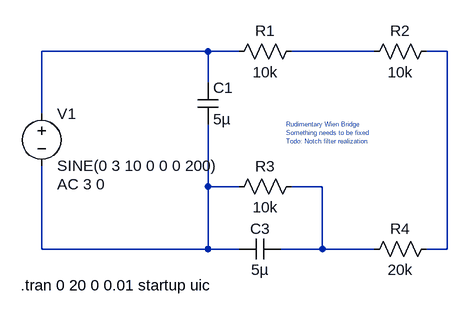
[diagram p0: schematic Wien Bridge (initial).asc]
Wien Bridge (initial).asc, the LTspice schematic file:
Version 4.1
SHEET 1 880 680
WIRE 288 32 32 32
WIRE 336 32 288 32
WIRE 544 32 416 32
WIRE 656 32 624 32
WIRE 288 80 288 32
WIRE 32 128 32 32
WIRE 288 240 288 144
WIRE 336 240 288 240
WIRE 464 240 416 240
WIRE 32 336 32 208
WIRE 288 336 288 240
WIRE 288 336 32 336
WIRE 336 336 288 336
WIRE 464 336 464 240
WIRE 464 336 400 336
WIRE 544 336 464 336
WIRE 656 336 656 32
WIRE 656 336 624 336
SYMBOL voltage 32 112 R0
WINDOW 123 24 124 Left 2
WINDOW 39 0 0 Left 0
SYMATTR InstName V1
SYMATTR Value SINE(0 3 10 0 0 0 200)
SYMATTR Value2 AC 3 0
SYMBOL res 432 16 R90
WINDOW 0 0 56 VBottom 2
WINDOW 3 32 56 VTop 2
SYMATTR InstName R1
SYMATTR Value 10k
SYMBOL res 640 16 R90
WINDOW 0 0 56 VBottom 2
WINDOW 3 32 56 VTop 2
SYMATTR InstName R2
SYMATTR Value 10k
SYMBOL res 432 224 R90
WINDOW 0 0 56 VBottom 2
WINDOW 3 32 56 VTop 2
SYMATTR InstName R3
SYMATTR Value 10k
SYMBOL res 640 320 R90
WINDOW 0 0 56 VBottom 2
WINDOW 3 32 56 VTop 2
SYMATTR InstName R4
SYMATTR Value 20k
SYMBOL cap 272 80 R0
SYMATTR InstName C1
SYMATTR Value 5µ
SYMBOL cap 400 320 R90
WINDOW 0 0 32 VBottom 2
WINDOW 3 32 32 VTop 2
SYMATTR InstName C3
SYMATTR Value 5µ
TEXT 0 392 Left 2 !.tran 0 20 0 0.01 startup uic
TEXT 408 144 Left 0 ;Rudimentary Wien Bridge\nSomething needs to be fixed\nTodo: Notch filter realization

The netlist it stands for:
* Wien Bridge (initial).asc
V1 N001 N004 SINE(0 3 10 0 0 0 200) AC 3 0
R1 N002 N001 10k
R2 N003 N002 10k
R3 N005 N004 10k
R4 N003 N005 20k
C1 N001 N004 5µ
C3 N005 N004 5µ
.tran 0 20 0 0.01 startup uic
* Rudimentary Wien Bridge
* Something needs to be fixed
* Todo: Notch filter realization
.backanno
.end